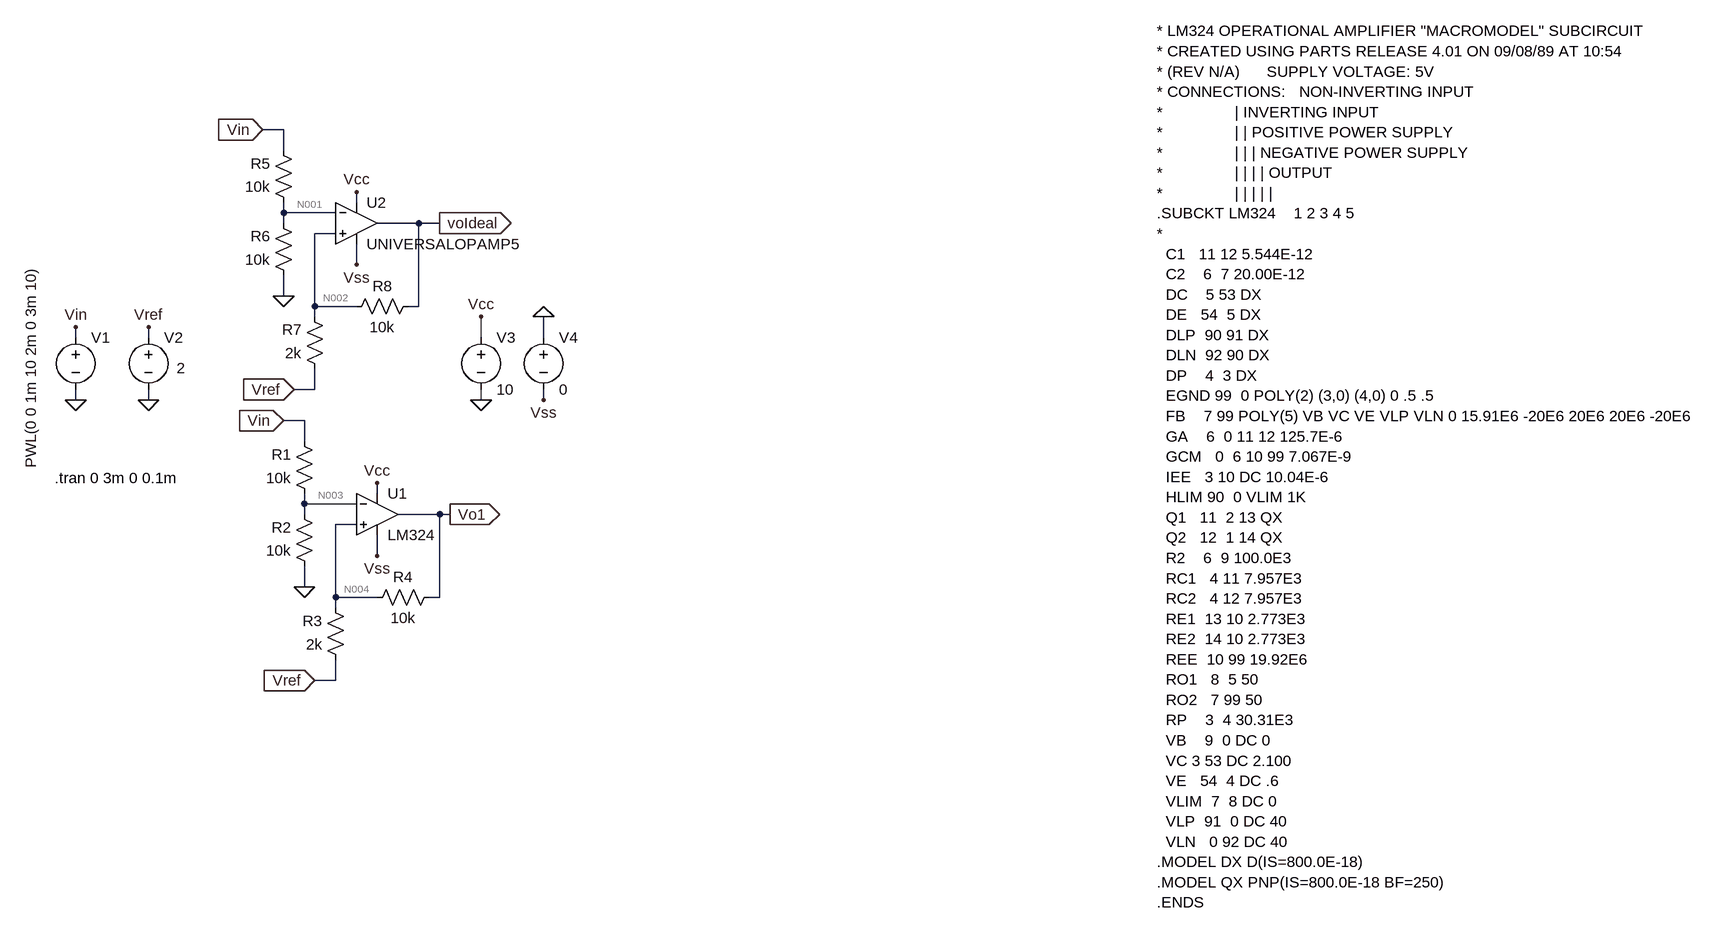
[diagram p0: schematic L1_C4.asc]
L1_C4.asc, the LTspice schematic file:
Version 4.1
SHEET 1 2516 10852
WIRE 0 -400 -32 -400
WIRE 0 -368 0 -400
WIRE 112 -288 112 -304
WIRE 0 -272 0 -288
WIRE 80 -272 0 -272
WIRE 0 -256 0 -272
WIRE 208 -256 144 -256
WIRE 240 -256 208 -256
WIRE 80 -240 48 -240
WIRE 112 -192 112 -224
WIRE 0 -144 0 -176
WIRE 48 -128 48 -240
WIRE 112 -128 48 -128
WIRE 208 -128 208 -256
WIRE 208 -128 192 -128
WIRE 48 -112 48 -128
WIRE -320 -80 -320 -96
WIRE -208 -80 -208 -96
WIRE 304 -80 304 -112
WIRE 400 -80 400 -112
WIRE 48 0 48 -32
WIRE 48 0 16 0
WIRE -320 16 -320 0
WIRE -208 16 -208 0
WIRE 304 16 304 0
WIRE 400 16 400 0
WIRE 32 48 0 48
WIRE 32 80 32 48
WIRE 144 160 144 144
WIRE 32 176 32 160
WIRE 112 176 32 176
WIRE 32 192 32 176
WIRE 240 192 176 192
WIRE 256 192 240 192
WIRE 112 208 80 208
WIRE 144 256 144 224
WIRE 32 304 32 272
WIRE 80 320 80 208
WIRE 144 320 80 320
WIRE 240 320 240 192
WIRE 240 320 224 320
WIRE 80 336 80 320
WIRE 80 448 80 416
WIRE 80 448 48 448
FLAG -320 16 0
FLAG 304 16 0
FLAG -320 -96 Vin
FLAG 400 -112 0
FLAG 304 -112 Vcc
FLAG 144 144 Vcc
FLAG 400 16 Vss
FLAG 144 256 Vss
FLAG 256 192 Vo1
IOPIN 256 192 Out
FLAG 32 304 0
FLAG -208 16 0
FLAG -208 -96 Vref
FLAG 48 448 Vref
IOPIN 48 448 In
FLAG 0 48 Vin
IOPIN 0 48 In
FLAG 112 -304 Vcc
FLAG 112 -192 Vss
FLAG 0 -144 0
FLAG 16 0 Vref
IOPIN 16 0 In
FLAG -32 -400 Vin
IOPIN -32 -400 In
FLAG 240 -256 voIdeal
IOPIN 240 -256 Out
SYMBOL res 48 176 R180
WINDOW 0 36 76 Left 2
WINDOW 3 36 40 Left 2
SYMATTR InstName R1
SYMATTR Value 10k
SYMBOL res 48 288 R180
WINDOW 0 36 76 Left 2
WINDOW 3 36 40 Left 2
SYMATTR InstName R2
SYMATTR Value 10k
SYMBOL res 96 432 R180
WINDOW 0 36 76 Left 2
WINDOW 3 36 40 Left 2
SYMATTR InstName R3
SYMATTR Value 2k
SYMBOL res 240 304 R90
WINDOW 0 0 56 VBottom 2
WINDOW 3 32 56 VTop 2
SYMATTR InstName R4
SYMATTR Value 10k
SYMBOL voltage -320 -96 R0
WINDOW 123 0 0 Left 0
WINDOW 39 0 0 Left 0
WINDOW 3 -69 -94 VRight 2
SYMATTR Value PWL(0 0 1m 10 2m 0 3m 10)
SYMATTR InstName V1
SYMBOL voltage 304 -96 R0
WINDOW 123 0 0 Left 0
WINDOW 39 0 0 Left 0
SYMATTR InstName V3
SYMATTR Value 10
SYMBOL OpAmps\\opamp2 144 128 R0
SYMATTR InstName U1
SYMATTR Value LM324
SYMBOL voltage -208 -96 R0
WINDOW 123 0 0 Left 0
WINDOW 39 0 0 Left 0
WINDOW 3 43 63 Left 2
SYMATTR Value 2
SYMATTR InstName V2
SYMBOL voltage 400 -96 R0
WINDOW 123 0 0 Left 0
WINDOW 39 0 0 Left 0
SYMATTR InstName V4
SYMATTR Value 0
SYMBOL res 16 -272 R180
WINDOW 0 36 76 Left 2
WINDOW 3 36 40 Left 2
SYMATTR InstName R5
SYMATTR Value 10k
SYMBOL res 16 -160 R180
WINDOW 0 36 76 Left 2
WINDOW 3 36 40 Left 2
SYMATTR InstName R6
SYMATTR Value 10k
SYMBOL res 64 -16 R180
WINDOW 0 36 76 Left 2
WINDOW 3 36 40 Left 2
SYMATTR InstName R7
SYMATTR Value 2k
SYMBOL res 208 -144 R90
WINDOW 0 0 56 VBottom 2
WINDOW 3 32 56 VTop 2
SYMATTR InstName R8
SYMATTR Value 10k
SYMBOL OpAmps\\UniversalOpAmp5 112 -256 R0
SYMATTR InstName U2
TEXT 1344 -552 Left 2 !* LM324 OPERATIONAL AMPLIFIER "MACROMODEL" SUBCIRCUIT\n* CREATED USING PARTS RELEASE 4.01 ON 09/08/89 AT 10:54\n* (REV N/A)      SUPPLY VOLTAGE: 5V\n* CONNECTIONS:   NON-INVERTING INPUT\n*                | INVERTING INPUT\n*                | | POSITIVE POWER SUPPLY\n*                | | | NEGATIVE POWER SUPPLY\n*                | | | | OUTPUT\n*                | | | | |\n.SUBCKT LM324    1 2 3 4 5\n*\n  C1   11 12 5.544E-12\n  C2    6  7 20.00E-12\n  DC    5 53 DX\n  DE   54  5 DX\n  DLP  90 91 DX\n  DLN  92 90 DX\n  DP    4  3 DX\n  EGND 99  0 POLY(2) (3,0) (4,0) 0 .5 .5\n  FB    7 99 POLY(5) VB VC VE VLP VLN 0 15.91E6 -20E6 20E6 20E6 -20E6\n  GA    6  0 11 12 125.7E-6\n  GCM   0  6 10 99 7.067E-9\n  IEE   3 10 DC 10.04E-6\n  HLIM 90  0 VLIM 1K\n  Q1   11  2 13 QX\n  Q2   12  1 14 QX\n  R2    6  9 100.0E3\n  RC1   4 11 7.957E3\n  RC2   4 12 7.957E3\n  RE1  13 10 2.773E3\n  RE2  14 10 2.773E3\n  REE  10 99 19.92E6\n  RO1   8  5 50\n  RO2   7 99 50\n  RP    3  4 30.31E3\n  VB    9  0 DC 0\n  VC 3 53 DC 2.100\n  VE   54  4 DC .6\n  VLIM  7  8 DC 0\n  VLP  91  0 DC 40\n  VLN   0 92 DC 40\n.MODEL DX D(IS=800.0E-18)\n.MODEL QX PNP(IS=800.0E-18 BF=250)\n.ENDS
TEXT -352 136 Left 2 !.tran 0 3m 0 0.1m

The netlist it stands for:
* L1_C4.asc
R1 N003 Vin 10k
R2 0 N003 10k
R3 Vref N004 2k
R4 Vo1 N004 10k
V1 Vin 0 PWL(0 0 1m 10 2m 0 3m 10)
V3 Vcc 0 10
X§U1 N004 N003 Vcc Vss Vo1 LM324  ; pins In+ In- V+ V- OUT
V2 Vref 0 2
V4 0 Vss 0
R5 N001 Vin 10k
R6 0 N001 10k
R7 Vref N002 2k
R8 voIdeal N002 10k
X§U2 N002 N001 Vcc Vss voIdeal level5 Avol=1Meg GBW=10Meg Phimargin=45 SlewPos=10Meg SlewNeg=10Meg En=0 Enk=0 In=0 Ink=0 Rcm=500Meg Ccm=1p Rdiff=500k Cdiff=2p Ro=1k Vos=0 Ibp=2n Ibn=1n Iq=1m Rail=0 Ilimit=25m  ; UNIVERSALOPAMP5, pins In+ In- V+ V- OUT
* LM324 OPERATIONAL AMPLIFIER "MACROMODEL" SUBCIRCUIT
* CREATED USING PARTS RELEASE 4.01 ON 09/08/89 AT 10:54
* (REV N/A)      SUPPLY VOLTAGE: 5V
* CONNECTIONS:   NON-INVERTING INPUT
*                | INVERTING INPUT
*                | | POSITIVE POWER SUPPLY
*                | | | NEGATIVE POWER SUPPLY
*                | | | | OUTPUT
*                | | | | |
.SUBCKT LM324    1 2 3 4 5
*
  C1   11 12 5.544E-12
  C2    6  7 20.00E-12
  DC    5 53 DX
  DE   54  5 DX
  DLP  90 91 DX
  DLN  92 90 DX
  DP    4  3 DX
  EGND 99  0 POLY(2) (3,0) (4,0) 0 .5 .5
  FB    7 99 POLY(5) VB VC VE VLP VLN 0 15.91E6 -20E6 20E6 20E6 -20E6
  GA    6  0 11 12 125.7E-6
  GCM   0  6 10 99 7.067E-9
  IEE   3 10 DC 10.04E-6
  HLIM 90  0 VLIM 1K
  Q1   11  2 13 QX
  Q2   12  1 14 QX
  R2    6  9 100.0E3
  RC1   4 11 7.957E3
  RC2   4 12 7.957E3
  RE1  13 10 2.773E3
  RE2  14 10 2.773E3
  REE  10 99 19.92E6
  RO1   8  5 50
  RO2   7 99 50
  RP    3  4 30.31E3
  VB    9  0 DC 0
  VC 3 53 DC 2.100
  VE   54  4 DC .6
  VLIM  7  8 DC 0
  VLP  91  0 DC 40
  VLN   0 92 DC 40
.MODEL DX D(IS=800.0E-18)
.MODEL QX PNP(IS=800.0E-18 BF=250)
.ENDS
.tran 0 3m 0 0.1m
.backanno
.end

* Results of the author's LTspice run, read from the files saved beside the schematic
* Operating Point, zero values left out:
*   V(n004) = 3.083 V
*   V(vo1) = 8.496 V
*   V(voideal) = 10 V
*   V(n003) = 204.4 µV
*   V(vref) = 2 V
*   V(vcc) = 10 V
*   V(n001) = 32.94 mV
*   V(n002) = 3.322 V
*   I(R3) = -541.3 µA
*   I(V1) = 3.314 µA
*   I(R5) = 3.294 µA
*   I(R6) = -3.294 µA
*   I(R8) = 667.7 µA
*   I(R1) = 20.44 nA
*   I(V3) = -2 mA
*   I(V2) = 1.202 mA
*   I(R2) = -20.44 nA
*   I(R4) = 541.3 µA
*   I(R7) = -661.1 µA
*   I(V4) = -1.34 mA
*   Ix(u2:1) = 6.577 µA
*   Ix(u2:2) = -6.588 µA
*   Ix(u2:3) = 1.668 mA
*   Ix(u2:4) = -1 mA
*   Ix(u2:5) = -667.7 µA
*   Ix(u1:1) = 5.536 pA
*   Ix(u1:2) = -40.87 nA
*   Ix(u1:3) = 331.8 µA
*   Ix(u1:4) = -340.1 µA
*   Ix(u1:5) = -541.3 µA
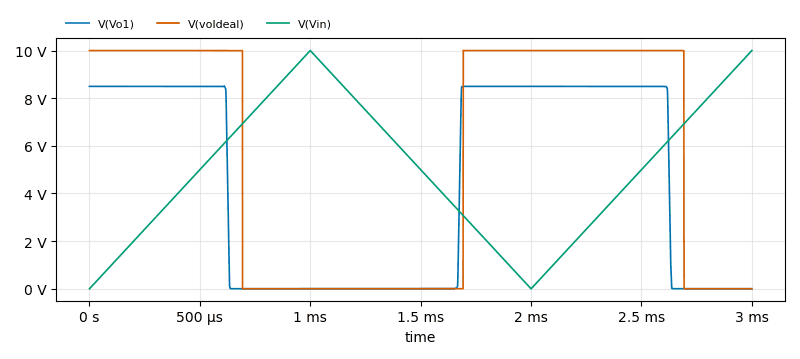
[diagram p1: Transient Analysis of L1_C4.asc, plotted from the saved traces]
* Transient Analysis, 1 run:
*   V(Vo1): min 4.294 mV, max 8.513 V, average 4.467 V, rms 6.145 V, last 4.296 mV
*   V(voIdeal): min 436 µV, max 10.01 V, average 5.642 V, rms 7.51 V, last 437.1 µV
*   V(Vin): min 0 V, max 10 V, average 5 V, rms 6.057 V, last 10 V